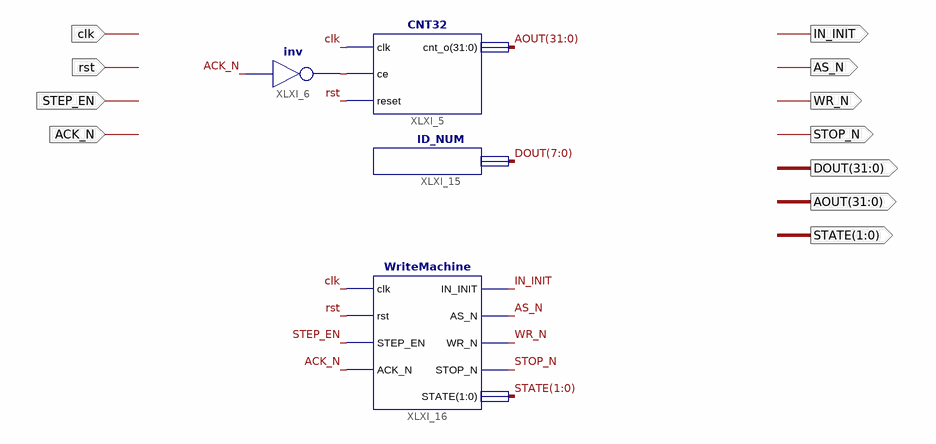
[diagram p0: schematic sheet 1]
// Xilinx ISE schematic WriteMachineSuite.sch (spartan6) as structural Verilog: 4 symbols, 11 ports
module WriteMachineSuite (
  input  clk,
  input  rst,
  input  STEP_EN,
  input  ACK_N,
  output IN_INIT,
  output AS_N,
  output WR_N,
  output STOP_N,
  output [1:0] STATE,
  output [31:0] AOUT,
  output [31:0] DOUT
);

  wire XLXN_35;

  CNT32 XLXI_5 (.clk(clk), .ce(XLXN_35), .reset(rst), .cnt_o(AOUT));
  not XLXI_6 (XLXN_35, ACK_N);
  ID_NUM XLXI_15 (.ID(DOUT[7:0]));
  WriteMachine XLXI_16 (
    .clk(clk), .rst(rst), .STEP_EN(STEP_EN), .ACK_N(ACK_N), .IN_INIT(IN_INIT), .AS_N(AS_N), .WR_N(WR_N),
    .STOP_N(STOP_N), .STATE(STATE));
endmodule
